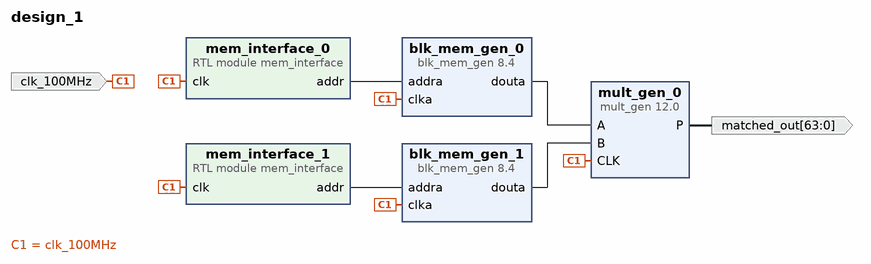
[diagram p0: block diagram of the top level]
# Vivado block design design_1, xc7z010clg400-2, Vivado 2025.2
create_bd_design design_1

create_bd_port -dir I -type clk clk_100MHz
set_property -dict {CONFIG.FREQ_HZ 100000000} [get_bd_ports clk_100MHz]
create_bd_port -dir O -from 63 -to 0 matched_out

create_bd_cell -type ip -vlnv xilinx.com:ip:blk_mem_gen:8.4 blk_mem_gen_0
set_property -dict [list \
  CONFIG.Coe_File ../../../../Matlab/Signal/Signal_1.coe \
  CONFIG.Enable_A Always_Enabled \
  CONFIG.Fill_Remaining_Memory_Locations false \
  CONFIG.Load_Init_File true \
  CONFIG.Read_Width_A 32 \
  CONFIG.Use_RSTA_Pin false \
  CONFIG.Write_Depth_A 2048 \
  CONFIG.Write_Width_A 32 \
  CONFIG.use_bram_block Stand_Alone \
] [get_bd_cells blk_mem_gen_0]
create_bd_cell -type module -reference mem_interface mem_interface_0
create_bd_cell -type ip -vlnv xilinx.com:ip:mult_gen:12.0 mult_gen_0
set_property -dict [list \
  CONFIG.MultType Parallel_Multiplier \
  CONFIG.Multiplier_Construction Use_Mults \
  CONFIG.PortAWidth 32 \
  CONFIG.PortBWidth 32 \
] [get_bd_cells mult_gen_0]
create_bd_cell -type module -reference mem_interface mem_interface_1
create_bd_cell -type ip -vlnv xilinx.com:ip:blk_mem_gen:8.4 blk_mem_gen_1
set_property -dict [list \
  CONFIG.Coe_File ../../../../Matlab/Signal/Signal_1.coe \
  CONFIG.Enable_A Always_Enabled \
  CONFIG.Fill_Remaining_Memory_Locations false \
  CONFIG.Load_Init_File true \
  CONFIG.Read_Width_A 32 \
  CONFIG.Use_RSTA_Pin false \
  CONFIG.Write_Depth_A 2048 \
  CONFIG.Write_Width_A 32 \
  CONFIG.use_bram_block Stand_Alone \
] [get_bd_cells blk_mem_gen_1]

# ---- connections ----

connect_bd_net [get_bd_ports clk_100MHz] \
  [get_bd_pins blk_mem_gen_1/clka] [get_bd_pins mult_gen_0/CLK] [get_bd_pins blk_mem_gen_0/clka] \
  [get_bd_pins mem_interface_0/clk] [get_bd_pins mem_interface_1/clk]
connect_bd_net [get_bd_pins blk_mem_gen_0/douta] [get_bd_pins mult_gen_0/A]
connect_bd_net [get_bd_pins blk_mem_gen_1/douta] [get_bd_pins mult_gen_0/B]
connect_bd_net [get_bd_pins mem_interface_0/addr] [get_bd_pins blk_mem_gen_0/addra]
connect_bd_net [get_bd_pins mem_interface_1/addr] [get_bd_pins blk_mem_gen_1/addra]
connect_bd_net [get_bd_pins mult_gen_0/P] [get_bd_ports matched_out]

validate_bd_design
save_bd_design
